# EAGLE design TFT_adapter_BB (EAGLE 7.7.0)
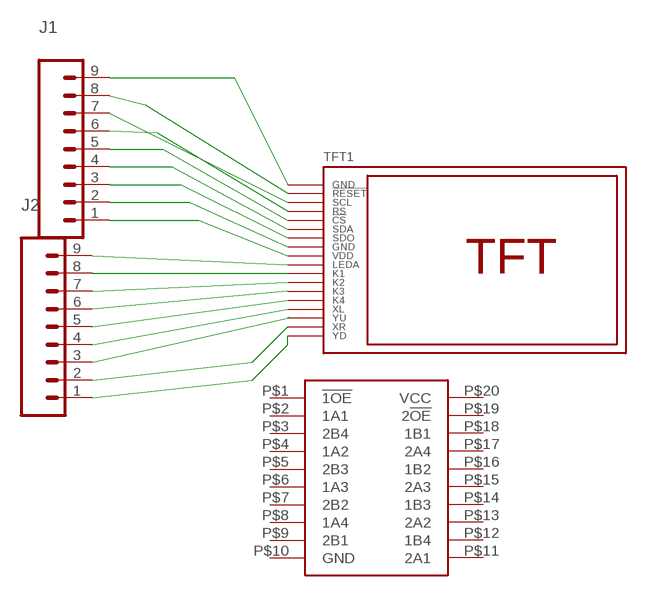
[diagram p0: schematic, sheet 1]

## Parts
J1  M09NO_SILK  [1X09_NO_SILK]
J2  M09NO_SILK  [1X09_NO_SILK]
TFT1  TFT-18-1.0MM  [TFT-CONN-18]
U$1  CBT3244AD  [S020-75MM]

## Nets
GND: J1.3 J1.9 TFT1.1(GND) TFT1.7(SDO)
GND2: J1.2 TFT1.8(GND)
LEDA: J2.9 TFT1.10(LEDA)
N$2: J1.8 TFT1.2(!RESET)
N$3: J1.7 TFT1.3(SCL)
N$4: J1.6 TFT1.4(RS)
N$5: J1.5 TFT1.5(!CS)
N$6: J1.4 TFT1.6(SDA)
N$10: J2.1 TFT1.18(YD)
N$11: J2.2 TFT1.17(XR)
N$12: J2.3 TFT1.16(YU)
N$13: J2.4 TFT1.15(XL)
N$14: J2.5 TFT1.14(K4)
N$15: J2.7 TFT1.12(K2)
N$16: J2.6 TFT1.13(K3)
N$17: J2.8 TFT1.11(K1)
VDD: J1.1 TFT1.9(VDD)
Unconnected: U$1.P$1(!1OE) U$1.P$2(1A1) U$1.P$3(2B4) U$1.P$4(1A2) U$1.P$5(2B3) U$1.P$6(1A3) U$1.P$7(2B2) U$1.P$8(1A4) U$1.P$9(2B1) U$1.P$11(2A1) U$1.P$12(1B4) U$1.P$13(2A2) U$1.P$14(1B3) U$1.P$15(2A3) U$1.P$16(1B2) U$1.P$17(2A4) U$1.P$18(1B1) U$1.P$19(2!OE)

## Power pins joined to a net without a drawn wire
GND: U$1.P$10(GND)
VCC: U$1.P$20(VCC)

## Library data of the parts
J1 J2 = SparkFun-Connectors:M09: Header 9 Standard 9-pin 0.1" header. Use with straight break away headers (SKU : PRT-00116), right angle break away headers (PRT-00553), swiss pins (PRT-00743), machine pins (PRT-00117), and female headers (PRT-00115).
TFT1 = custom:TFT-18-1.0MM
U$1 = custom:CBT3244AD

## Board
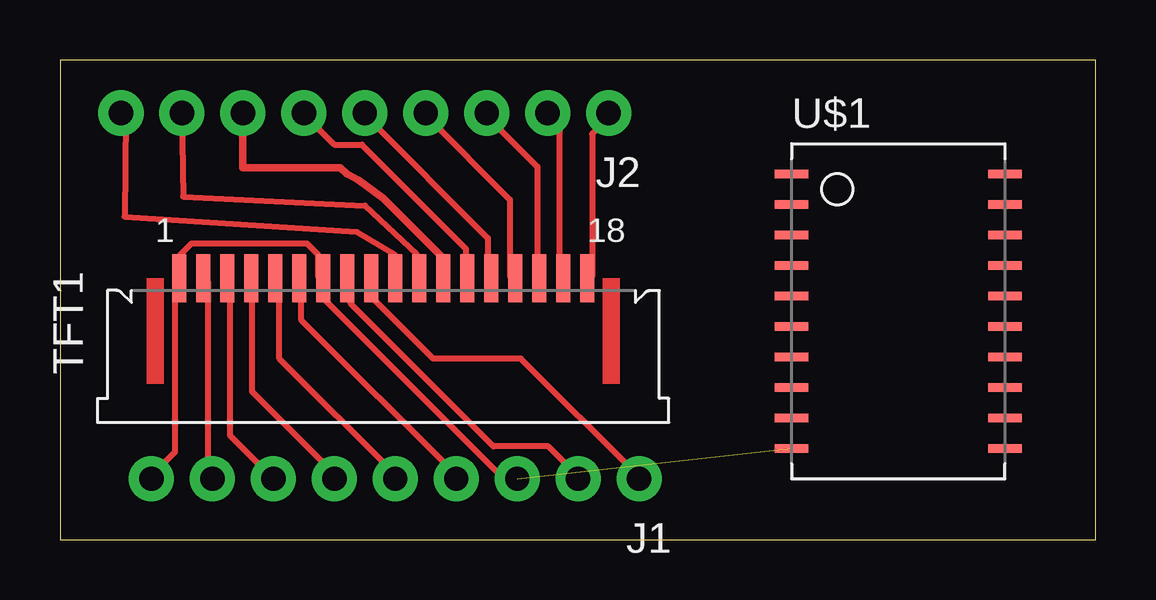
[diagram p1: board, top side]

Size 43.16 x 19.99 mm. Coordinates in mm from the lower left corner, seen from the top.
Outline: 0,0 43.16,0 43.16,19.99 0,19.99 0,0
Copper layers (1*16): Top 0.035mm / dielectric 1.5mm / Bottom 0.035mm
Design rules "default *": minimum track width 10mil, minimum drill 24mil, track to track 12mil, track to pad 12mil, pad to pad 12mil, via to via 12mil, smd to smd 12mil, copper to edge 40mil, drill to drill 8mil, minimum pad ring 10mil, minimum via ring 8mil, stop-mask expansion 4mil, vias tented up to drill 0mil, thermal gap 10mil

### Footprints (pad centres in the part's own frame; a part is rotated, then mirrored left to right if it is on the bottom)
1X09_NO_SILK = drill 1.016 pad 1.88: 1 0,0; 2 2.54,0; 3 5.08,0; 4 7.62,0; 5 10.16,0; 6 12.7,0; 7 15.24,0; 8 17.78,0; 9 20.32,0
TFT-CONN-18 = smd 0.6 x 2: 1 -9,2; 2 -8,2; 3 -7,2; 4 -6,2; 5 -5,2; 6 -4,2; 7 -3,2; 8 -2,2; 9 -1,2; 10 0,2; 11 1,2; 12 2,2; 13 3,2; 14 4,2; 15 5,2; 16 6,2; 17 7,2; 18 8,2
S020-75MM = smd 1.397 x 0.356: P$1 -3.81,0; P$2 -3.81,-1.27; P$3 -3.81,-2.54; P$4 -3.81,-3.81; P$5 -3.81,-5.08; P$6 -3.81,-6.35; P$7 -3.81,-7.62; P$8 -3.81,-8.89; P$9 -3.81,-10.16; P$10 -3.81,-11.43; P$11 5.08,0; P$12 5.08,-1.27; P$13 5.08,-2.54; P$14 5.08,-3.81; P$15 5.08,-5.08; P$16 5.08,-6.35; P$17 5.08,-7.62; P$18 5.08,-8.89; P$19 5.08,-10.16; P$20 5.08,-11.43

### Placement (x,y rotation side)
J1  24.13,2.54 180 top
J2  22.86,17.78 180 top
TFT1  13.97,8.89 0 top
U$1  34.29,15.24 0 top

### Tracks (layer width: path | path; a pad name or v marks a point on that pad's centre or on a via)
GND  (1 unrouted)
  Top 0.254: J1.9 3.89,2.74 4.8,3.66 4.8,10.74 TFT1.1 5.03,10.97 5.03,11.89 5.49,12.34 10.29,12.34 10.74,11.89 10.74,10.97 TFT1.7 10.97,10.74 10.97,10.06 18.29,2.74 18.97,2.74 J1.3
GND2
  Top 0.254: TFT1.8 12.12,10.74 12.12,9.83 18.06,3.89 20.34,3.89 21.49,2.74 J1.2
LEDA
  Top 0.254: TFT1.10 13.95,10.97 13.95,11.89 12.37,12.83 2.69,13.46 2.74,17.6 J2.9
N$2
  Top 0.254: TFT1.2 6.17,10.74 6.17,2.74 J1.8
N$3
  Top 0.254: J1.7 7.09,4.34 7.09,10.74 TFT1.3
N$4
  Top 0.254: TFT1.4 8,10.74 8,6.17 11.43,2.74 J1.6
N$5
  Top 0.254: TFT1.5 9.14,10.74 9.14,7.54 13.95,2.74 J1.5
N$6
  Top 0.254: TFT1.6 10.06,10.74 10.06,9.14 16.46,2.74 J1.4
N$10
  Top 0.254: TFT1.18 22.17,10.97 22.17,16.92 22.86,17.6 J2.1
N$11
  Top 0.254: TFT1.17 20.8,10.97 20.8,17.14 20.34,17.6 J2.2
N$12
  Top 0.254: TFT1.16 19.89,10.97 19.89,15.54 17.83,17.6 J2.3
N$13
  Top 0.254: TFT1.15 18.75,10.97 18.75,14.17 15.32,17.6 J2.4
N$14
  Top 0.254: TFT1.14 17.83,10.97 17.83,12.57 12.8,17.6 J2.5
N$15
  Top 0.305: J2.7 7.62,15.49 11.68,15.49 11.94,15.24 12.45,14.99 13.46,14.22 16,11.68 TFT1.12
N$16
  Top 0.254: TFT1.13 16.92,10.97 16.92,12.12 12.57,16.46 11.43,16.46 10.29,17.6 J2.6
N$17
  Top 0.254: J2.8 5.13,14.3 12.7,13.92 14.86,11.89 14.86,10.97 TFT1.11
VDD
  Top 0.254: TFT1.9 13.03,10.74 13.03,10.06 15.54,7.54 19.2,7.54 24,2.74 J1.1